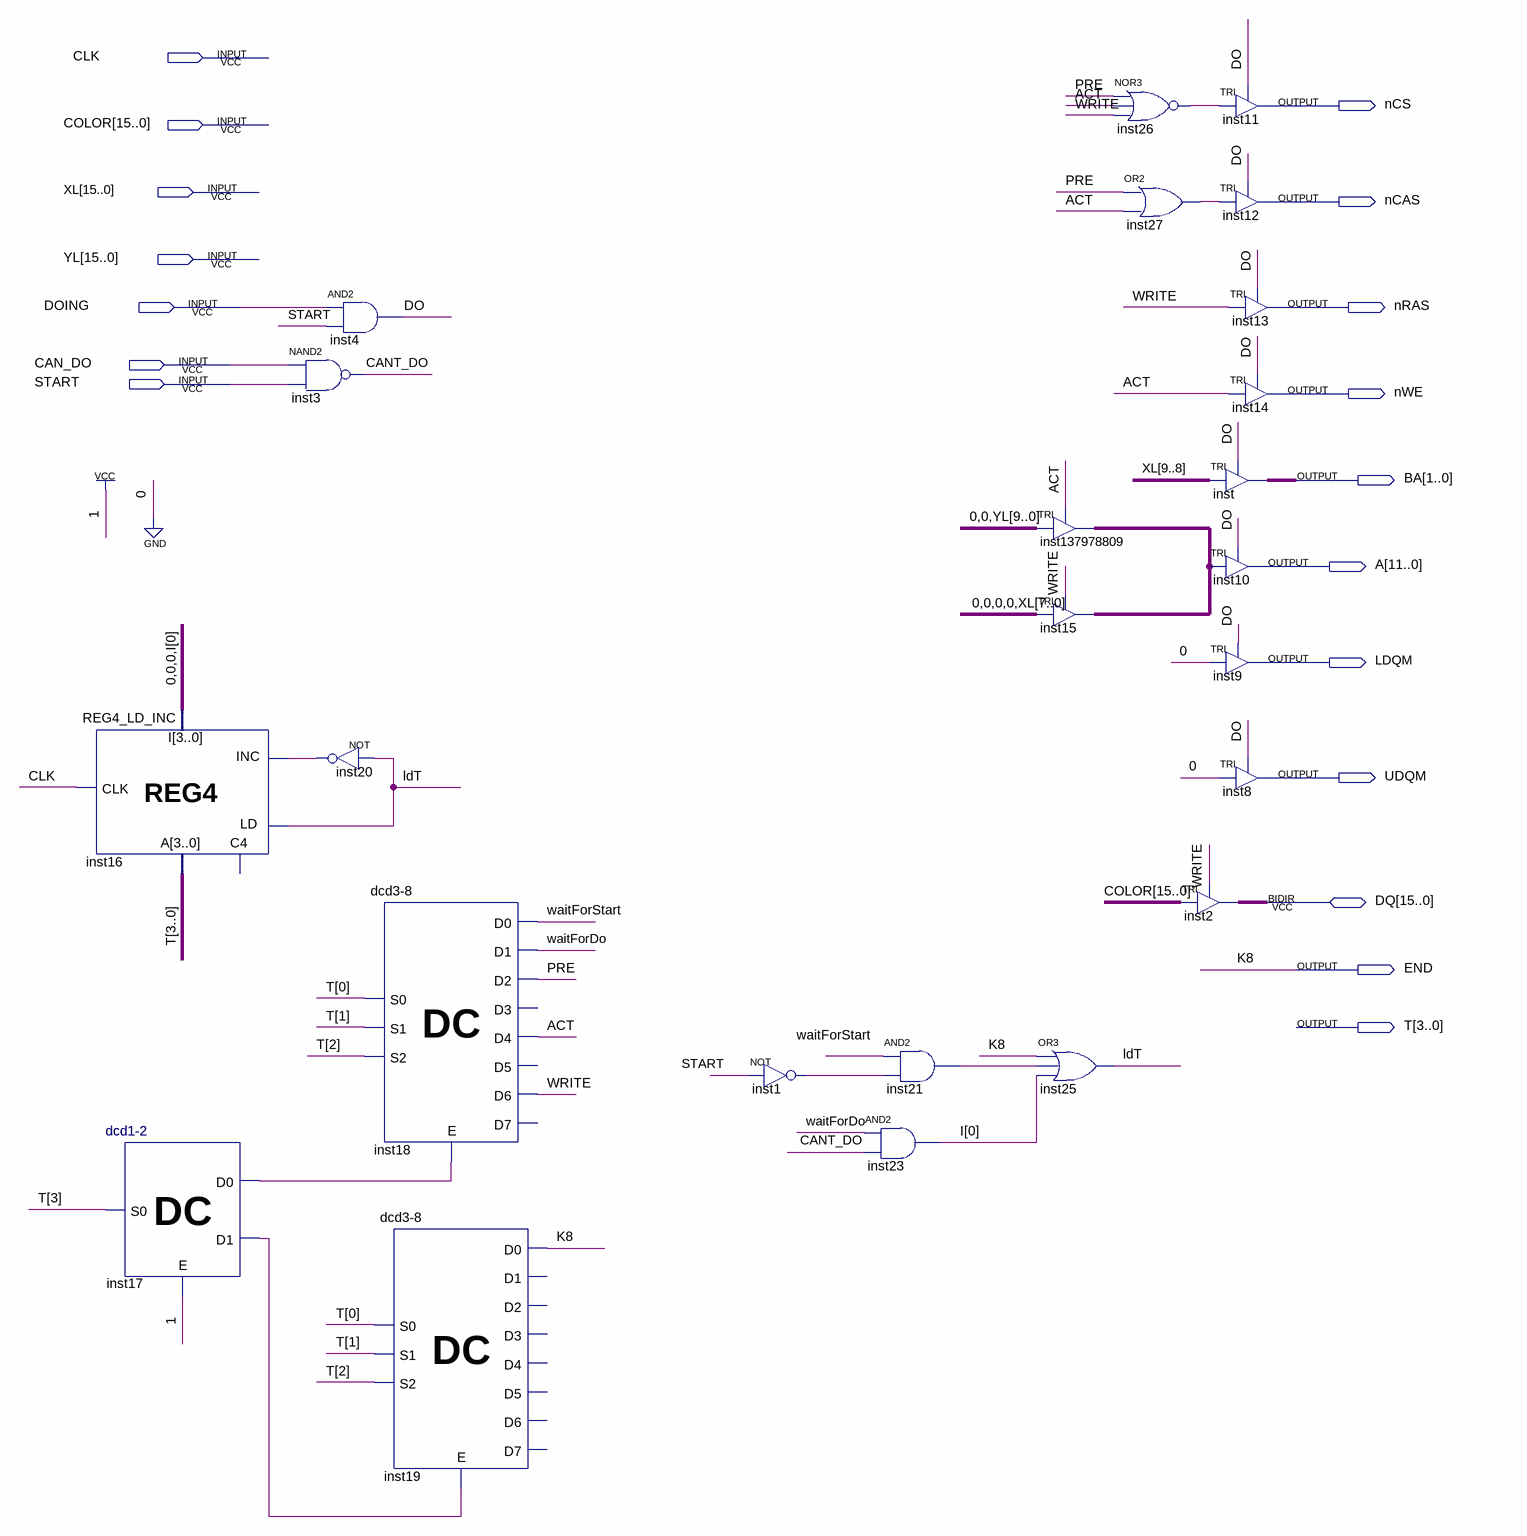
[diagram p0: schematic sheet]
// Quartus schematic GPU_write_pixel.bdf as structural Verilog: 24 symbols, 18 pins
module GPU_write_pixel (
  input  CLK,
  input  [15:0] COLOR,
  input  [15:0] XL,
  input  [15:0] YL,
  input  DOING,
  input  CAN_DO,
  input  START,
  inout  [15:0] DQ,
  output nCS,
  output nCAS,
  output nRAS,
  output nWE,
  output [1:0] BA,
  output [11:0] A,
  output LDQM,
  output UDQM,
  output END,
  output [3:0] T
);

  wire ACT, CANT_DO, DO, inst1_out, inst17_d0, inst17_d1, inst20_out, inst21_out, inst26_out, inst27_out,
       ldT, PRE, waitForDo, waitForStart, WRITE;
  wire [0:0] I;
  wire [11:0] inst137978809_out;

  REG4_LD_INC inst16 (.LD(ldT), .INC(inst20_out), .CLK(CLK), .I({3'b000, I[0]}), .A(T));  // open: C4
  \dcd1-2  inst17 (.E(1'b1), .S0(T[3]), .D0(inst17_d0), .D1(inst17_d1));
  and inst4 (DO, DOING, START);
  nand inst3 (CANT_DO, CAN_DO, START);
  not inst20 (inst20_out, ldT);
  \dcd3-8  inst18 (
    .E(inst17_d0), .S0(T[0]), .S1(T[1]), .S2(T[2]), .D0(waitForStart), .D1(waitForDo), .D2(PRE), .D4(ACT),
    .D6(WRITE));  // open: D3, D5, D7
  \dcd3-8  inst19 (.E(inst17_d1), .S0(T[0]), .S1(T[1]), .S2(T[2]), .D0(END));  // open: D1, D2, D3, D4, D5, D6, D7
  not inst1 (inst1_out, START);
  and inst23 (I[0], waitForDo, CANT_DO);
  and inst21 (inst21_out, waitForStart, inst1_out);
  TRI inst137978809[11:0] (.IN({2'b00, YL[9:0]}), .OE(ACT), .OUT(inst137978809_out));
  TRI inst15[11:0] (.IN({4'b0000, XL[7:0]}), .OE(WRITE), .OUT(inst137978809_out));
  or inst25 (ldT, END, inst21_out, I[0]);
  nor inst26 (inst26_out, PRE, ACT, WRITE);
  or inst27 (inst27_out, PRE, ACT);
  TRI inst11 (.IN(inst26_out), .OE(DO), .OUT(nCS));
  TRI inst12 (.IN(inst27_out), .OE(DO), .OUT(nCAS));
  TRI inst13 (.IN(WRITE), .OE(DO), .OUT(nRAS));
  TRI inst14 (.IN(ACT), .OE(DO), .OUT(nWE));
  TRI inst[1:0] (.IN(XL[9:8]), .OE(DO), .OUT(BA));
  TRI inst10[11:0] (.IN(inst137978809_out), .OE(DO), .OUT(A));
  TRI inst9 (.IN(1'b0), .OE(DO), .OUT(LDQM));
  TRI inst8 (.IN(1'b0), .OE(DO), .OUT(UDQM));
  TRI inst2[15:0] (.IN(COLOR), .OE(WRITE), .OUT(DQ));

  // Other names for the same wires on the sheet: K8 = END
endmodule
